# Altium schematic sheet universal driver.SchDoc
size A1
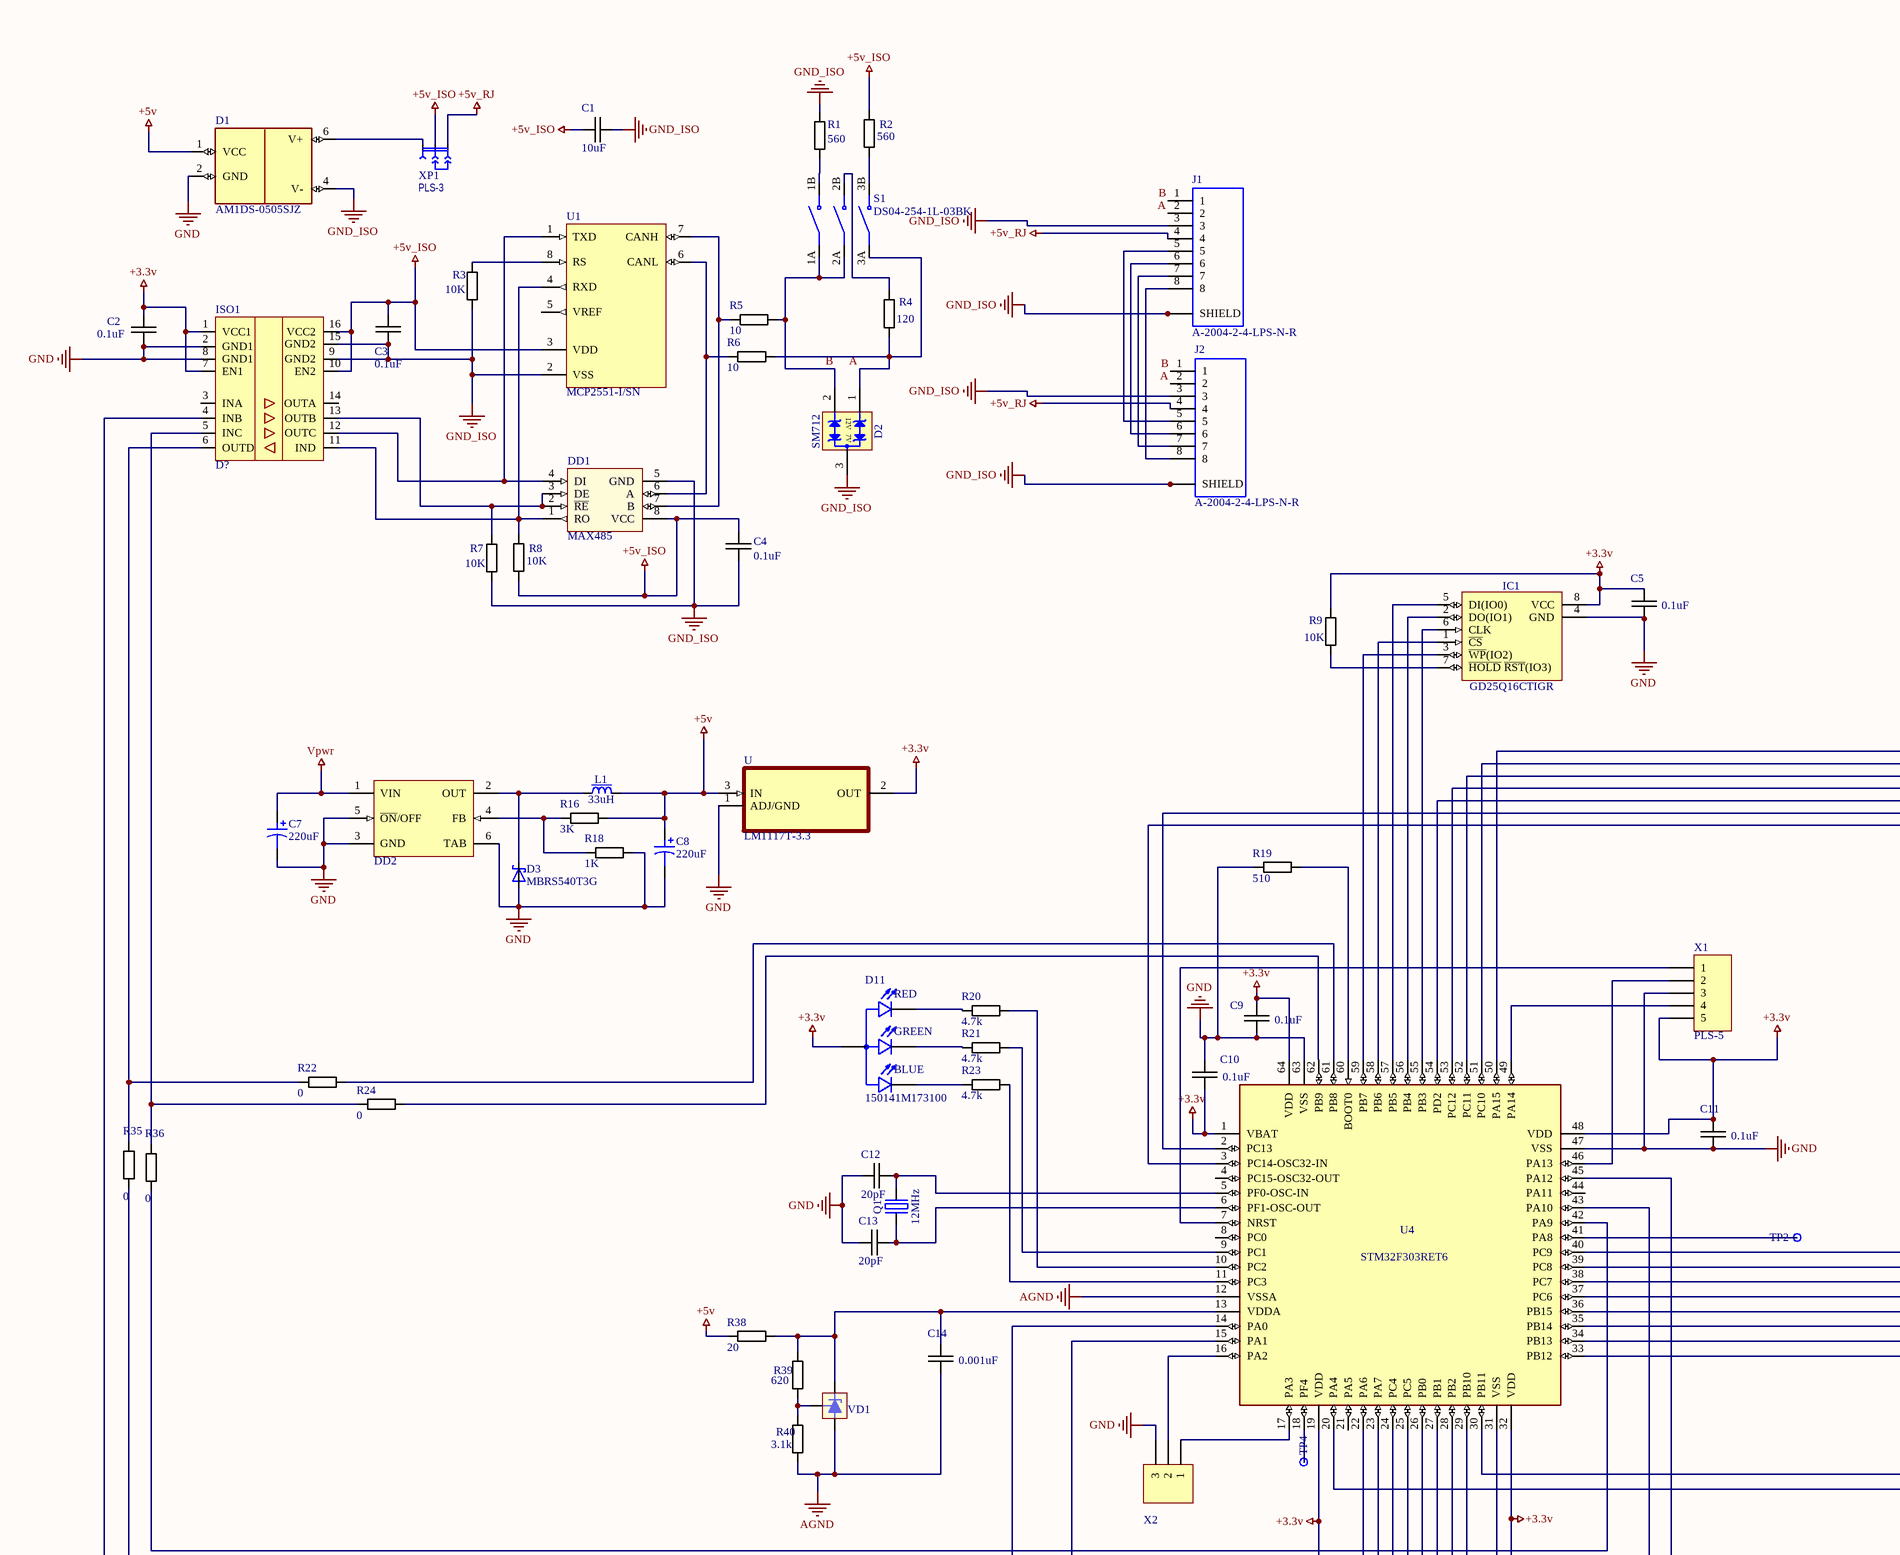
[diagram p0: universal driver.SchDoc, top left]
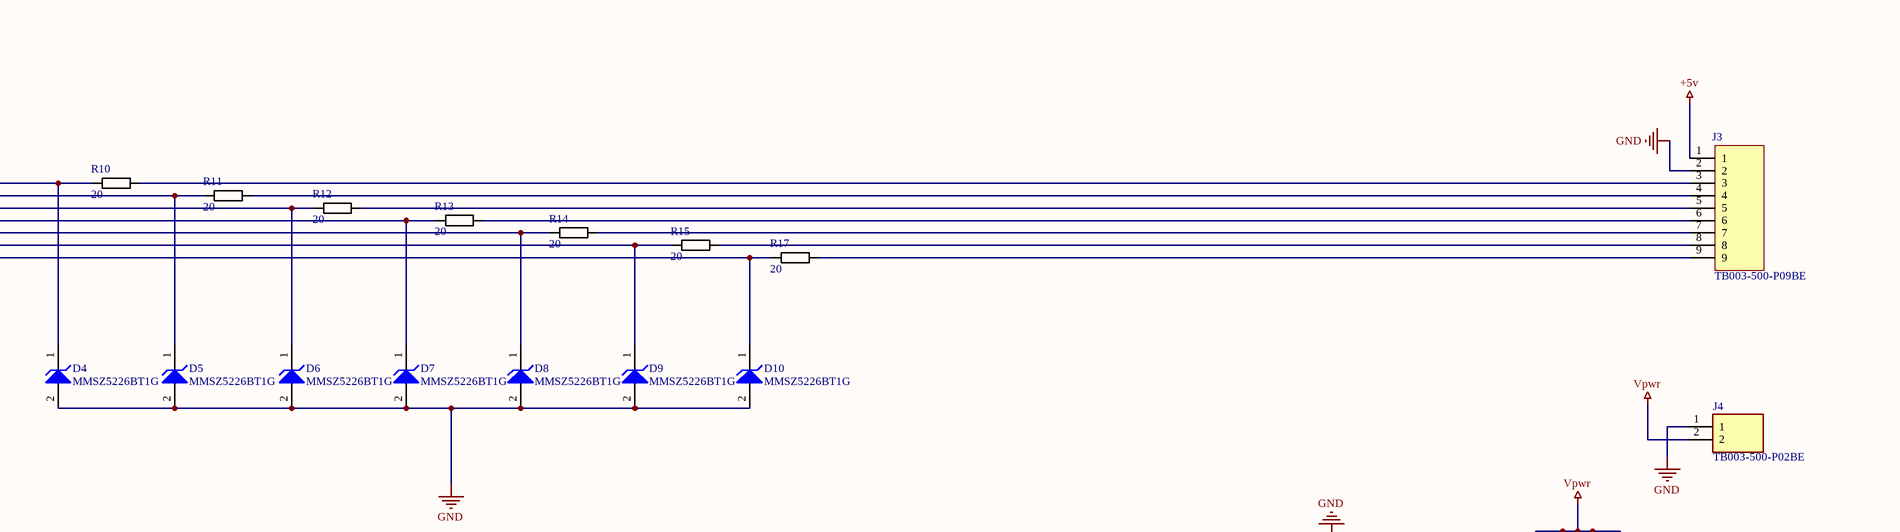
[diagram p1: universal driver.SchDoc, top right]
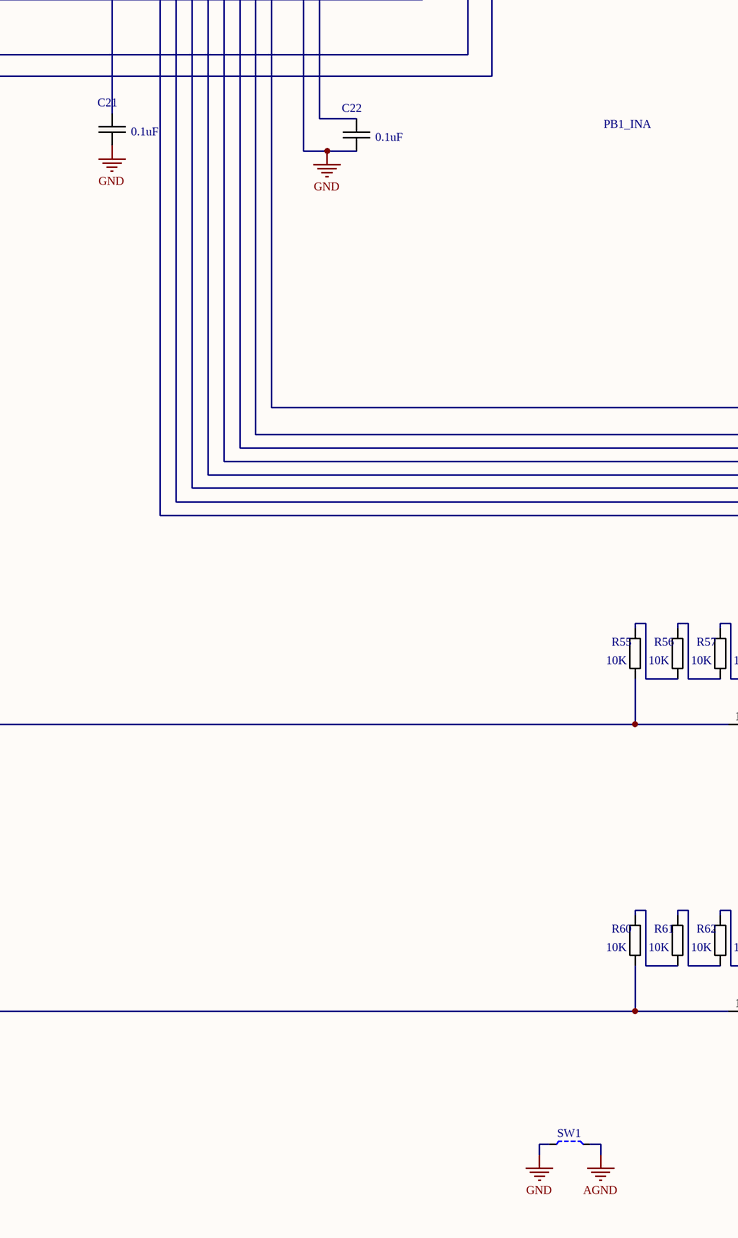
[diagram p2: universal driver.SchDoc, bottom left]
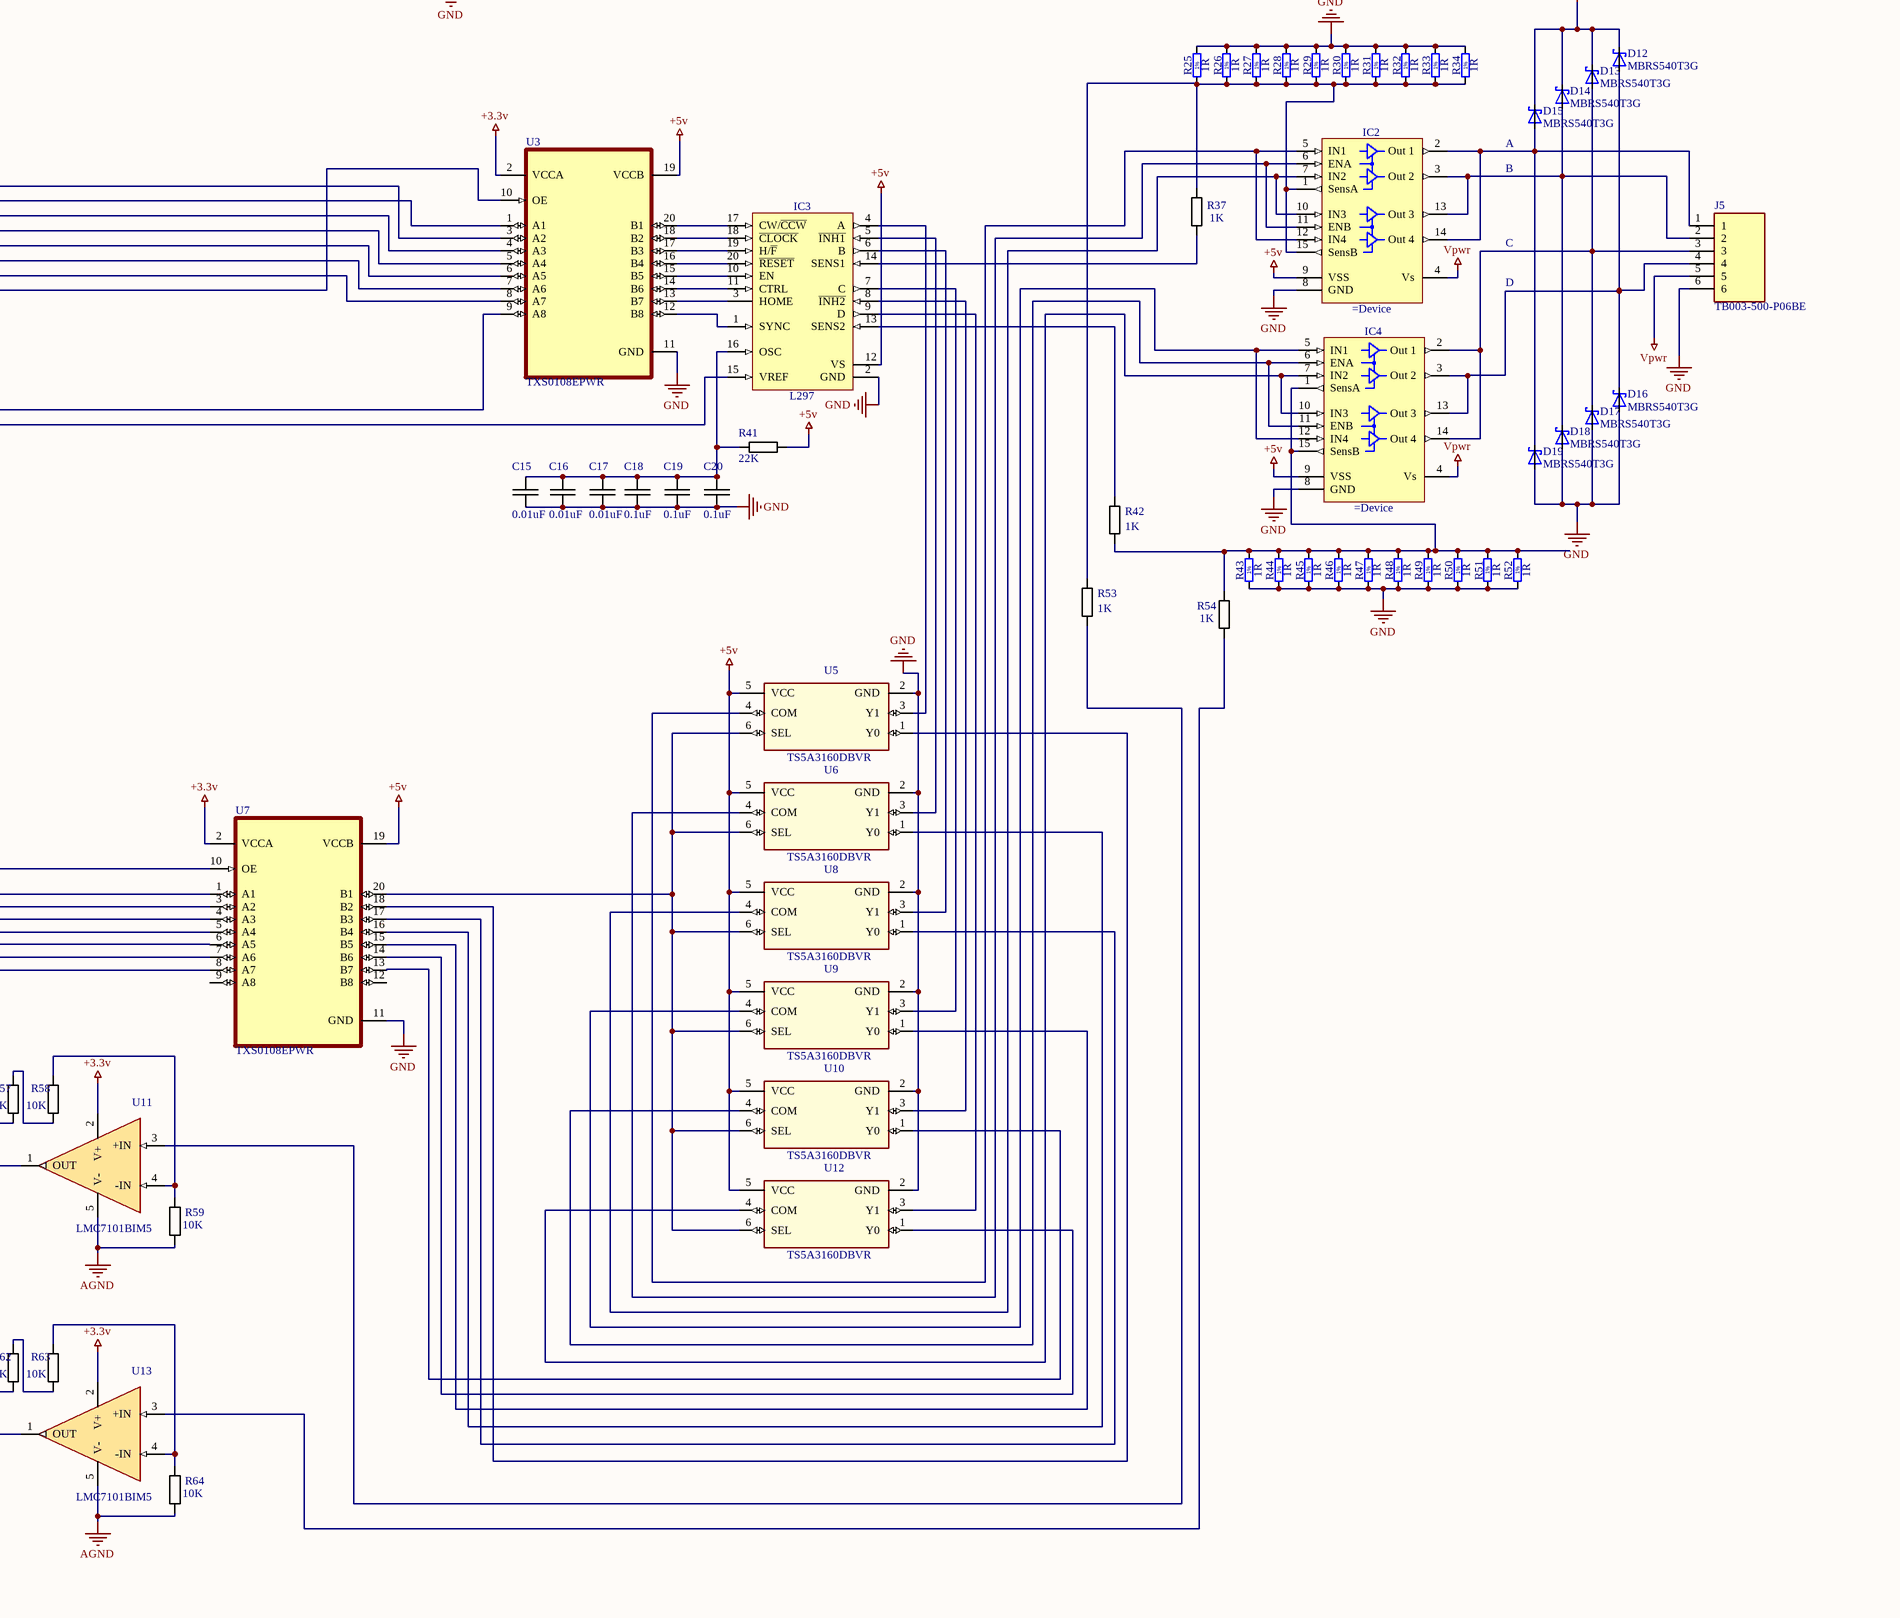
[diagram p3: universal driver.SchDoc, bottom right]

## Parts
C1  10uF  [CAPC3225X270N]
C2  0.1uF  [CAPACITOR 0603]
C3  0.1uF  [CAPACITOR 0603]
C4  0.1uF  [CAPACITOR 0603]
C5  0.1uF  [CAPACITOR 0603]
C7  value 220uF  [ECR 10x13mm]  (hidden comment: 220uF 50v)
C8  value 220uF  [ECR 10x13mm]  (hidden comment: 220uF 50v)
C9  0.1uF  [CAPACITOR 0603]
C10  0.1uF  [CAPACITOR 0603]
C11  0.1uF  [CAPACITOR 0603]
C12  20pF  [CAPACITOR 0603]
C13  20pF  [CAPACITOR 0603]
C14  0.001uF  [CAPACITOR 0603]
C15  0.01uF  [CAPACITOR 0603]
C16  0.01uF  [CAPACITOR 0603]
C17  0.01uF  [CAPACITOR 0603]
C18  0.1uF  [CAPACITOR 0603]
C19  0.1uF  [CAPACITOR 0603]
C20  0.1uF  [CAPACITOR 0603]
C21  0.1uF  [CAPACITOR 0603]
C22  0.1uF  [CAPACITOR 0603]
D1  AM1DS-0505SJZ  [AM2D-NZ]
D2  SM712  [SOT23]
D3  MBRS540T3G  [DIOM7958X213N]
D4  MMSZ5226BT1G  [ONSC-SOD-123-2-425-04_V]
D5  MMSZ5226BT1G  [ONSC-SOD-123-2-425-04_V]
D6  MMSZ5226BT1G  [ONSC-SOD-123-2-425-04_V]
D7  MMSZ5226BT1G  [ONSC-SOD-123-2-425-04_V]
D8  MMSZ5226BT1G  [ONSC-SOD-123-2-425-04_V]
D9  MMSZ5226BT1G  [ONSC-SOD-123-2-425-04_V]
D10  MMSZ5226BT1G  [ONSC-SOD-123-2-425-04_V]
D11  150141M173100  [LED_150141M173100]
D12  MBRS540T3G  [DIOM7958X213N]
D13  MBRS540T3G  [DIOM7958X213N]
D14  MBRS540T3G  [DIOM7958X213N]
D15  MBRS540T3G  [DIOM7958X213N]
D16  MBRS540T3G  [DIOM7958X213N]
D17  MBRS540T3G  [DIOM7958X213N]
D18  MBRS540T3G  [DIOM7958X213N]
D19  MBRS540T3G  [DIOM7958X213N]
DD1  MAX485  [NSO8]
DD2  LM2596S-ADJ  [TO-263]  (value not drawn)
IC1  GD25Q16CTIGR  [NSO8]
IC2  (no value)  [MW-15]
IC3  L297  [DIP850W45P254L2540H393Q20]
IC4  (no value)  [MW-15]
ISO1  D?  [*SOIC127P1030X265-16N]
J1  A-2004-2-4-LPS-N-R  [ASSMANN_A-2004-2-4-LPS-N-R]
J2  A-2004-2-4-LPS-N-R  [ASSMANN_A-2004-2-4-LPS-N-R]
J3  TB003-500-P09BE  [*CUI_TB003-500-P09BE]
J4  TB003-500-P02BE  [CUI_TB003-500-P02BE]
J5  TB003-500-P06BE  [CUI_TB003-500-P06BE]
L1  33uH  [SRR1208]
Q1  12MHz  [HC49SM]
R1  560  [Resistor 0805]
R2  560  [Resistor 0805]
R3  10K  [Resistor 0805]
R4  120  [Resistor 0805]
R5  10  [Resistor 0805]
R6  10  [Resistor 0805]
R7  10K  [Resistor 0805]
R8  10K  [Resistor 0805]
R9  10K  [Resistor 0805]
R10  20  [Resistor 0805]
R11  20  [Resistor 0805]
R12  20  [Resistor 0805]
R13  20  [Resistor 0805]
R14  20  [Resistor 0805]
R15  20  [Resistor 0805]
R16  3K  [Resistor 0805]
R17  20  [Resistor 0805]
R18  1K  [Resistor 0805]
R19  510  [Resistor 0805]
R20  4.7k  [Resistor 0805]
R21  4.7k  [Resistor 0805]
R22  0  [Resistor 0805]
R23  4.7k  [Resistor 0805]
R24  0  [Resistor 0805]
R25  1R  [R2512]
R26  1R  [R2512]
R27  1R  [R2512]
R28  1R  [R2512]
R29  1R  [R2512]
R30  1R  [R2512]
R31  1R  [R2512]
R32  1R  [R2512]
R33  1R  [R2512]
R34  1R  [R2512]
R35  0  [Resistor 0805]
R36  0  [Resistor 0805]
R37  1K  [Resistor 0805]
R38  20  [Resistor 0805]
R39  620  [Resistor 0805]
R40  3.1k  [Resistor 0805]
R41  22K  [Resistor 0805]
R42  1K  [Resistor 0805]
R43  1R  [R2512]
R44  1R  [R2512]
R45  1R  [R2512]
R46  1R  [R2512]
R47  1R  [R2512]
R48  1R  [R2512]
R49  1R  [R2512]
R50  1R  [R2512]
R51  1R  [R2512]
R52  1R  [R2512]
R53  1K  [Resistor 0805]
R54  1K  [Resistor 0805]
R55  10K  [Resistor 0805]
R56  10K  [Resistor 0805]
R57  10K  [Resistor 0805]
R58  10K  [Resistor 0805]
R59  10K  [Resistor 0805]
R60  10K  [Resistor 0805]
R61  10K  [Resistor 0805]
R62  10K  [Resistor 0805]
R63  10K  [Resistor 0805]
R64  10K  [Resistor 0805]
S1  DS04-254-1L-03BK  [SW_DS04-254-1L-03BK]
SW1  (no value)  [R - 1206]
TP2  (no value)  [TestPoint_SMD]
TP4  (no value)  [TestPoint_SMD]
U  LM1117T-3.3  [TO254P470X1016X2222-3P]
U1  MCP2551-I/SN  [SOIC-SN8_L]
U3  TXS0108EPWR  [SOP65P640X120-20N]
U4  STM32F303RET6  [QFP50P1200X1200X160-64N]
U5  TS5A3160DBVR  [*SOT95P280X145-6N]
U6  TS5A3160DBVR  [*SOT95P280X145-6N]
U7  TXS0108EPWR  [SOP65P640X120-20N]
U8  TS5A3160DBVR  [*SOT95P280X145-6N]
U9  TS5A3160DBVR  [*SOT95P280X145-6N]
U10  TS5A3160DBVR  [*SOT95P280X145-6N]
U11  LMC7101BIM5  [*SOT95P280X145-5N]
U12  TS5A3160DBVR  [*SOT95P280X145-6N]
U13  LMC7101BIM5  [*SOT95P280X145-5N]
VD1  TL431  [SOT23]  (value not drawn)
X1  PLS-5  [PLS-5-3D]
X2  PLS2-3  [PLS-3-2]  (value not drawn)
XP1  PLS-3  [ZL201-3]

## Nets
+3.3v: C2.1 C5.1 C9.1 C10.2 C11.1 C21.1 C22.1 D11.1(A) IC1.8(VCC) ISO1.1(VCC1) ISO1.7(EN1) R9.1 U.2(OUT) U3.2(VCCA) U4.1(VBAT) U4.19(VDD) U4.32(VDD) U4.48(VDD) U4.64(VDD) U7.2(VCCA) U11.2(V+) U13.2(V+) X1.5
+5v: C8.1 D1.1(VCC) IC2.9(VSS) IC3.12(VS) IC4.9(VSS) J3.1 L1.2 R16.2 R38.2 R41.2 U.3(IN) U3.19(VCCB) U5.5(VCC) U6.5(VCC) U7.19(VCCB) U8.5(VCC) U9.5(VCC) U10.5(VCC) U12.5(VCC)
+5v_ISO: C1.2 C3.2 C4.2 DD1.8(VCC) ISO1.10(EN2) ISO1.16(VCC2) R2.2 R8.1 U1.3(VDD) XP1.2
+5v_RJ: J1.4 J2.4 XP1.1
AGND: C14.2 R40.2 R59.1 R64.1 SW1.2 U4.12(VSSA) U11.5(V-) U13.5(V-) VD1.3(A)
GND: C2.2 C5.2 C7.2 C8.2 C9.2 C10.1 C11.2 C12.1 C13.1 C15.2 C16.2 C17.2 C18.2 C19.2 C20.2 C21.2 C22.2 D1.2(GND) D3.A D4.2(A) D5.2(A) D6.2(A) D7.2(A) D8.2(A) D9.2(A) D10.2(A) D16.A D17.A D18.A D19.A DD2.3(GND) DD2.5(~{ON}/OFF) DD2.6(TAB) IC1.4(GND) IC2.8(GND) IC3.2(GND) IC4.8(GND) ISO1.2(GND1) ISO1.8(GND1) J3.2 J4.1 J5.6 R18.2 R19.2 R25.2 R26.2 R27.2 R28.2 R29.2 R30.2 R31.2 R32.2 R33.2 R34.2 R43.1 R44.1 R45.1 R46.1 R47.1 R48.1 R49.1 R50.1 R51.1 R52.1 SW1.1 U.1(ADJ/GND) U3.11(GND) U4.31(VSS) U4.47(VSS) U4.63(VSS) U5.2(GND) U6.2(GND) U7.11(GND) U8.2(GND) U9.2(GND) U10.2(GND) U12.2(GND) X1.3 X2.3
GND_ISO: C1.1 C3.1 C4.1 D1.4(V-) D2.3(GND) DD1.5(GND) ISO1.9(GND2) ISO1.15(GND2) J1.3 J1.S1(SHIELD) J1.S2(SHIELD) J2.3 J2.S1(SHIELD) J2.S2(SHIELD) R1.2 R3.1 R7.2 U1.2(VSS)
Vpwr: C7.1 D12.C D13.C D14.C D15.C DD2.1(VIN) IC2.4(Vs) IC4.4(Vs) J4.2 J5.5
A: D2.1(I/O1) J1.2 J2.2 R4.2 R6.1 S1.3A(COM3)
B: D2.2(I/O2) J1.1 J2.1 R5.1 S1.1A(COM1) S1.2A(COM2)
NetC12_2: C12.2 Q1.2(OSC2) U4.5(PF0-OSC-IN)
NetC13_2: C13.2 Q1.1(OSC1) U4.6(PF1-OSC-OUT)
NetC14_1: C14.1 R38.1 R39.1 U4.13(VDDA) VD1.1(K)
NetC15_1: C15.1 C16.1 C17.1 C18.1 C19.1 C20.1 IC3.16(OSC) R41.1
NetD1_6: D1.6(V+) XP1.3
NetD3_C: D3.C DD2.2(OUT) L1.1
NetD4_1: D4.1(K) R10.2 U4.50(PA15)
NetD5_1: D5.1(K) R11.2 U4.51(PC10)
NetD6_1: D6.1(K) R12.2 U4.52(PC11)
NetD7_1: D7.1(K) R13.2 U4.53(PC12)
NetD8_1: D8.1(K) R14.2 U4.54(PD2)
NetD9_1: D9.1(K) R15.2 U4.2(PC13)
NetD10_1: D10.1(K) R17.2 U4.3(PC14-OSC32-IN)
NetD11_2: D11.2(B_C) R23.2
NetD11_3: D11.3(R_C) R20.2
NetD11_4: D11.4(G_C) R21.2
NetD12_A: D12.A D16.C IC4.3(Out_2) IC4.13(Out_3) J5.4
NetD13_A: D13.A D17.C IC4.2(Out_1) IC4.14(Out_4) J5.3
NetD14_A: D14.A D18.C IC2.3(Out_2) IC2.13(Out_3) J5.2
NetD15_A: D15.A D19.C IC2.2(Out_1) IC2.14(Out_4) J5.1
NetDD1_1: DD1.1(RO) ISO1.11(IND) R8.2 U1.4(RXD)
NetDD1_2: DD1.2(~{RE}) DD1.3(DE) ISO1.13(OUTB) R7.1
NetDD1_4: DD1.4(DI) ISO1.12(OUTC) U1.1(TXD)
NetDD1_6: DD1.6(A) R6.2 U1.6(CANL)
NetDD1_7: DD1.7(B) R5.2 U1.7(CANH)
NetDD2_4: DD2.4(FB) R16.1 R18.1
NetIC1_1: IC1.1(~{CS}) U4.58(PB6)
NetIC1_2: IC1.2(DO(IO1)) U4.56(PB4)
NetIC1_3: IC1.3(~{WP}(IO2)) U4.59(PB7)
NetIC1_5: IC1.5(DI(IO0)) U4.57(PB5)
NetIC1_6: IC1.6(CLK) U4.55(PB3)
NetIC1_7: IC1.7(~{HOLD}_~{RST}(IO3)) R9.2
NetIC2_1: IC2.1(SensA) IC2.15(SensB) R25.1 R26.1 R27.1 R28.1 R29.1 R30.1 R31.1 R32.1 R33.1 R34.1 R37.2 R53.2
NetIC2_5: IC2.5(IN1) IC2.12(IN4) U5.4(COM)
NetIC2_6: IC2.6(ENA) IC2.11(ENB) U6.4(COM)
NetIC2_7: IC2.7(IN2) IC2.10(IN3) U8.4(COM)
NetIC3_1: IC3.1(SYNC) U3.12(B8)
NetIC3_3: IC3.3(HOME) U3.13(B7)
NetIC3_4: IC3.4(A) U5.3(Y1)
NetIC3_5: IC3.5(~{INH1}) U6.3(Y1)
NetIC3_6: IC3.6(B) U8.3(Y1)
NetIC3_7: IC3.7(C) U9.3(Y1)
NetIC3_8: IC3.8(~{INH2}) U10.3(Y1)
NetIC3_9: IC3.9(D) U12.3(Y1)
NetIC3_10: IC3.10(EN) U3.15(B5)
NetIC3_11: IC3.11(CTRL) U3.14(B6)
NetIC3_13: IC3.13(SENS2) R42.2
NetIC3_14: IC3.14(SENS1) R37.1
NetIC3_15: IC3.15(VREF) U4.20(PA4)
NetIC3_17: IC3.17(CW/~{CCW}) U3.20(B1)
NetIC3_18: IC3.18(~{CLOCK}) U3.18(B2)
NetIC3_19: IC3.19(H/~{F}) U3.17(B3)
NetIC3_20: IC3.20(~{RESET}) U3.16(B4)
NetIC4_1: IC4.1(SensA) IC4.15(SensB) R42.1 R43.2 R44.2 R45.2 R46.2 R47.2 R48.2 R49.2 R50.2 R51.2 R52.2 R54.2
NetIC4_5: IC4.5(IN1) IC4.12(IN4) U9.4(COM)
NetIC4_6: IC4.6(ENA) IC4.11(ENB) U10.4(COM)
NetIC4_7: IC4.7(IN2) IC4.10(IN3) U12.4(COM)
NetISO1_4: ISO1.4(INB) U4.45(PA12)
NetISO1_5: ISO1.5(INC) R24.2 R36.1
NetISO1_6: ISO1.6(OUTD) R22.2 R35.1
NetJ1_5: J1.5 J2.5
NetJ1_6: J1.6 J2.6
NetJ1_7: J1.7 J2.7
NetJ1_8: J1.8 J2.8
NetJ3_3: J3.3 R10.1
NetJ3_4: J3.4 R11.1
NetJ3_5: J3.5 R12.1
NetJ3_6: J3.6 R13.1
NetJ3_7: J3.7 R14.1
NetJ3_8: J3.8 R15.1
NetJ3_9: J3.9 R17.1
NetR1_1: R1.1 S1.1B(NO1)
NetR2_1: R2.1 S1.3B(NO3)
NetR3_2: R3.2 U1.8(RS)
NetR4_1: R4.1 S1.2B(NO2)
NetR19_1: R19.1 U4.60(BOOT0)
NetR20_1: R20.1 U4.10(PC2)
NetR21_1: R21.1 U4.9(PC1)
NetR22_1: R22.1 U4.61(PB8)
NetR23_1: R23.1 U4.11(PC3)
NetR24_1: R24.1 U4.62(PB9)
NetR35_2: R35.2 U4.43(PA10)
NetR36_2: R36.2 U4.42(PA9)
NetR39_2: R39.2 R40.1 VD1.2(VREF)
NetR53_1: R53.1 U11.3(+IN)
NetR54_1: R54.1 U13.3(+IN)
NetR55_1: R55.1 R56.2
NetR55_2: R55.2 U4.15(PA1) U11.1(OUT)
NetR56_1: R56.1 R57.2
NetR57_1: R57.1 R58.2
NetR58_1: R58.1 R59.2 U11.4(-IN)
NetR60_1: R60.1 R61.2
NetR60_2: R60.2 U4.14(PA0) U13.1(OUT)
NetR61_1: R61.1 R62.2
NetR62_1: R62.1 R63.2
NetR63_1: R63.1 R64.2 U13.4(-IN)
NetTP2_1: TP2.1 U4.41(PA8)
NetTP4_1: TP4.1 U4.18(PF4)
NetU3_1: U3.1(A1) U4.39(PC8)
NetU3_3: U3.3(A2) U4.40(PC9)
NetU3_4: U3.4(A3) U4.38(PC7)
NetU3_5: U3.5(A4) U4.37(PC6)
NetU3_6: U3.6(A5) U4.36(PB15)
NetU3_7: U3.7(A6) U4.35(PB14)
NetU3_8: U3.8(A7) U4.34(PB13)
NetU3_9: U3.9(A8) U4.30(PB11)
NetU3_10: U3.10(OE) U4.33(PB12)
NetU4_7: U4.7(NRST) X1.1
NetU4_16: U4.16(PA2) X2.2
NetU4_17: U4.17(PA3) X2.1
NetU4_22: U4.22(PA6) U7.8(A7)
NetU4_23: U4.23(PA7) U7.7(A6)
NetU4_24: U4.24(PC4) U7.6(A5)
NetU4_25: U4.25(PC5) U7.5(A4)
NetU4_26: U4.26(PB0) U7.4(A3)
NetU4_27: U4.27(PB1) U7.3(A2)
NetU4_28: U4.28(PB2) U7.1(A1)
NetU4_29: U4.29(PB10) U7.10(OE)
NetU4_46: U4.46(PA13) X1.2
NetU4_49: U4.49(PA14) X1.4
NetU5_1: U5.1(Y0) U7.18(B2)
NetU5_6: U5.6(SEL) U6.6(SEL) U7.20(B1) U8.6(SEL) U9.6(SEL) U10.6(SEL) U12.6(SEL)
NetU6_1: U6.1(Y0) U7.16(B4)
NetU7_13: U7.13(B7) U10.1(Y0)
NetU7_14: U7.14(B6) U12.1(Y0)
NetU7_15: U7.15(B5) U9.1(Y0)
NetU7_17: U7.17(B3) U8.1(Y0)

Not connected (* = marked no-connect by the designer): ISO1 3(INA) 14(OUTA); U1 5(VREF); U4 4(PC15-OSC32-OUT) 8(PC0) 21(PA5) 44(PA11); U7 9(A8) 12(B8)

## Notes on the sheet
- (near D15) A
- B
- C
- D
- PB1_INA
- (in symbol 150141M173100) RED; GREEN; BLUE
- (in symbol Resistor - 1%) 1%
- (in symbol SM712) 12V; 7V

## Library data of the parts
C1-C5 C9-C22 = Capasitor: Value: *
C7 C8 = Cap Pol: Polarized Capacitor (Rad); Voltage: 50; Type: Type; URL: http://www.hitano.com.tw/PDF/ECR_081225.pdf
D2 = SM712: Asymmetrical TVS Diode for Extended Common-Mode RS-485
D3 D12-D19 = MBRS540T3G: Diode Schottky 40V 5A Surface Mount SMC; MF: ON Semiconductor; SnapEDA_Link: https://www.snapeda.com/parts/MBRS540T3G/ON%20Semiconductor/view-part/78777/?ref=snap; MP: MBRS540T3G; Availability: Unavailable; Price: None; Value: *; Package: DO-214 ON Semiconductor
D4-D10 = MMSZ5226BT1G: Zener Voltage Regulator, 500 mW, 2-Pin SOD-123, Pb-Free, Tape and Reel; Manufacturer: On Semiconductor; P Max (W): 0.5; VZ Typ (V): 3.3; DatasheetVersion: Rev. 12; PackageVersion: Rev. G, 10/2009; PackageReference: SOD-123-2-425-04; PackageDescription: 2-Pin SOD, Body 1.6 x 2.69 mm; Supplier 1: Digi-Key; Supplier Part Number 1: MMSZ5226BT1GOSTR-ND; Supplier 2: Digi-Key; Supplier Part Number 2: MMSZ5226BT1GOSCT-ND; Supplier 3: Digi-Key; Supplier Part Number 3: MMSZ5226BT1GOSDKR-ND; Supplier 4: Farnell; Supplier Part Number 4: 1431269; Supplier 5: Farnell; Supplier Part Number 5: 1431269RL; Supplier 6: Farnell; Supplier Part Number 6: 2370825; Supplier 7: Newark; Supplier Part Number 7: 67R1367; Supplier 8: Newark; Supplier Part Number 8: 45J1591; Supplier 9: Mouser; Supplier Part Number 9: 863-MMSZ5226BT1G; Packing: Tape and Reel; RoHS: Pb-Free; Mounting Technology: Surface Mount; PartNumber: MMSZ5226BT1G; ComponentLink1Description: Manufacturer URL; ComponentLink1URL: http://www.onsemi.com/; ComponentLink2Description: Datasheet; ComponentLink2URL: http://www.onsemi.com/pub_link/Collateral/MMSZ5221BT1-D.PDF; ComponentLink3Description: Package Specification; ComponentLink3URL: http://www.onsemi.com/pub_link/Collateral/425-04.PDF
D11 = 150141M173100: Red, Green, Blue _RGB_ 625nm Red, 520nm Green, 470nm Blue LED Indication - Discrete 2V Red, 3.2V Green, 3.2V Blue 1411 _3528 Metric_; MF: Wurth Electronics; SnapEDA_Link: https://www.snapeda.com/parts/150141M173100/Wurth%20Electronics%20Inc./view-part/281733/?ref=snap; Price: None; MP: 150141M173100; Package: 1411 WÃ¼rth Elektronik; Value: *; Availability: Unavailable
DD1 = MAX485: Low-Power, Slew-Rate-Limited RS-485/RS-422 Transceiver; ComponentLink1URL: http://pdfserv.maxim-ic.com/en/ds/MAX1487-MAX491.pdf; Type: MAX485
DD2 = LM2596S-ADJ: SIMPLE SWITCHER® Power Converter 150 KHz 3A Step-Down Voltage Regulator, 5-pin TO-263; Manufacturer: National Semiconductor; Published: 13.04.2012; Publisher: Reukov A.V.; PartNumber: LM2596S-ADJ; CompType: Switcher; ComponentLink1URL: http://www.national.com/ds/LM/LM2596.pdf; ComponentLink2URL: http://www.national.com/pf/LM/LM2596.html; ComponentLink3URL: http://www.national.com/packaging/folders/ts5b.html
IC1 = W25Q128FVEIG: 128M-bit Serial Flash Memory with uniform 4KB sectors and Dual/Quad SPI and QPI
IC2 IC4 = L298N: Dual Full-Bridge Driver
IC3 = L297: Stepper Motor Controller
ISO1 = ISO7341
J1 J2 = A-2004-2-4-LPS-N-R: Jack Modular Connector 8p8c _RJ45, Ethernet_ 90Â° Angle _Right_ Shielded; MF: Assmann WSW; Package: None; MP: A-2004-2-4-LPS-N-R; Value: *; Price: None; Availability: Unavailable; SnapEDA_Link: https://www.snapeda.com/parts/A-2004-2-4-LPS-N-R/Assmann%20WSW%20Components/view-part/454861/?ref=snap
J3 = TB003-500-P09BE: 2~24 Poles, Screw Type, Horizontal, 5.0 Pitch, 26~14 (AWG), Terminal Block Connector; MF: CUI Devices; Check_prices: https://www.snapeda.com/parts/TB003-500-P09BE/CUI%20Devices/view-part/3590672/?ref=eda; Availability: Warning; Price: None; MP: TB003-500-P09BE; DigiKey-Purchase-URL: https://snapeda.com/shop?store=DigiKey&id=3590672; Package: None; SnapEDA_Link: https://www.snapeda.com/parts/TB003-500-P09BE/CUI%20Devices/view-part/3590672/?ref=snap; Mouser-Purchase-URL: https://snapeda.com/shop?store=Mouser&id=3590672; CUI_purchase_URL: https://www.cuidevices.com/product/interconnect/connectors/terminal-blocks/tb003-500-series?utm_source=snapeda.com&utm_medium=referral&utm_campaign=snapedaBOM; Value: *
J4 = TB003-500-P02BE: 2~24 Poles, Screw Type, Horizontal, 5.0 Pitch, 26~14 _AWG_, Terminal Block Connector; MF: CUI Devices; MP: TB003-500-P02BE; Availability: Unavailable; Package: None; SnapEDA_Link: https://www.snapeda.com/parts/TB003-500-P02BE/CUI%20Devices/view-part/3590637/?ref=snap; Price: None; Value: *
J5 = TB003-500-P06BE: 2~24 Poles, Screw Type, Horizontal, 5.0 Pitch, 26~14 _AWG_, Terminal Block Connector; MF: CUI Devices; Value: *; Price: None; MP: TB003-500-P06BE; SnapEDA_Link: https://www.snapeda.com/parts/TB003-500-P06BE/CUI%20Devices/view-part/3590657/?ref=snap; Package: None; Availability: Unavailable
L1 = Inductor With Magnetic core: Inductor With Core
Q1 = Quartz Crystal
R1-R24 R35-R42 R53-R64 = Resistor: Value: *
R25-R34 R43-R52 = Resistor - 1%
S1 = DS04-254-1L-03BK: 3 Pole, Raised Actuator, Flat Bottom, Long Pin, DIP Switch; MF: CUI Devices; Price: None; SnapEDA_Link: https://www.snapeda.com/parts/DS04-254-1L-03BK/CUI%20Devices/view-part/4467361/?ref=snap; Availability: Unavailable; Value: *; MP: DS04-254-1L-03BK; Package: None
SW1 = SMD Solder Jumper: 2 SMD Pads for Bound by Solder  Drop
TP2 TP4 = Test Point
U = LM1117T-3.3: Linear Voltage Regulator IC 1 Output 800mA TO-220-3; MF: Texas Instruments; MP: LM1117T-3.3; Price: None; Availability: Unavailable; Package: TO-220 Texas Instruments; SnapEDA_Link: https://www.snapeda.com/parts/LM1117T-3.3/Texas%20Instruments/view-part/103788/?ref=snap; Value: *
U1 = MCP2551-I/SN: High-Speed CAN Transceiver, 8-Pin SOIC, Industrial Temperature; Published: 29-Jan-2009; DatasheetVersion: revE, Jan-2007; PackageVersion: revBB, Aug-2009; PackageReference: SOIC-SN8; Publisher: Altium Limited; PackageDescription: 8-Lead Plastic Small Outline (SN) - Narrow, 3.90mm Body [SOIC]; Supplier 1: Digi-Key; Supplier Part Number 1: MCP2551-I/SN-ND; Supplier 2: Farnell; Supplier Part Number 2: 9758569; Code_JEDEC: MS-012; Code_IPC: SOIC127P600-8; ComponentLink1Description: Datasheet; ComponentLink1URL: http://ww1.microchip.com/downloads/en/DeviceDoc/21667E.pdf; ComponentLink2Description: Packaging Specification; ComponentLink2URL: http://www.microchip.com/stellent/groups/techpub_sg/documents/packagingspec/en012702.pdf; ComponentLink3Description: Microchip.com Home; ComponentLink3URL: http://www.microchip.com/
U3 U7 = TXS0108EPWR: 8-Bit Bidirectional Voltage-Level Shifter For Open-Drain And Push-Pull Application; MF: Texas Instruments; DigiKey-Purchase-URL: https://snapeda.com/shop?store=DigiKey&id=105750; Value: *; MP: TXS0108EPWR; Texas_Instruments-Purchase-URL: https://snapeda.com/shop?store=Texas+Instruments&id=105750; Availability: Unavailable; Package: TSSOP-20 Texas Instruments; Mouser-Purchase-URL: https://snapeda.com/shop?store=Mouser&id=105750; SnapEDA_Link: https://www.snapeda.com/parts/TXS0108EPWR/Texas%20Instruments/view-part/105750/?ref=snap; Price: None
U4 = STM32F303RET6: ARMÂ® CortexÂ®-M4 STM32F3 Microcontroller IC 32-Bit 72MHz 512KB _512K x 8_ FLASH 64-LQFP _10x10_; MF: STMicroelectronics; SnapEDA_Link: https://www.snapeda.com/parts/STM32F303RET6/STMicroelectronics/view-part/226642/?ref=snap; Availability: Unavailable; MP: STM32F303RET6; Value: *; Price: None; Package: LQFP-64 STMicroelectronics
U5 U6 U8-U10 U12 = TS5A3160DBVR: 1-?, 5-V, 2:1 (SPDT), analog switch (6-pin SOT-23, SC70 packages) 6-SOT-23 -40 to 85; MF: Texas Instruments; DigiKey-Purchase-URL: https://snapeda.com/shop?store=DigiKey&id=332002; Arrow_Electronics-Purchase-URL: https://snapeda.com/shop?store=Arrow+Electronics&id=332002; Texas_Instruments-Purchase-URL: https://snapeda.com/shop?store=Texas+Instruments&id=332002; Package: SOT-23-6 Texas Instruments; Availability: Good; MP: TS5A3160DBVR; Check_prices: https://www.snapeda.com/parts/TS5A3160DBVR/Texas%20Instruments/view-part/332002/?ref=eda; Mouser-Purchase-URL: https://snapeda.com/shop?store=Mouser&id=332002; SnapEDA_Link: https://www.snapeda.com/parts/TS5A3160DBVR/Texas%20Instruments/view-part/332002/?ref=snap; Price: None; Value: *
VD1 = TL431: Adjustable Precision Shunt Regulator; Class: Электронные компоненты; SubClass: Стабилитроны; Power_W: {Power_W}; Pitch_mm: {Pitch_mm}; Ordering_Information: {Ordering_Information}; Nominal_voltage_V: {Nominal_voltage_V}; Installation: {Installation}; Body: {Body}; Pins: 3; Value: TL431
X1 = PLS-5: Header, 5-Pin; LatestRevisionDate: 17-Jul-2002; LatestRevisionNote: Re-released for DXP Platform.; Publisher: Altium Limited
X2 = PLS2-3: Header, 3-Pin; LatestRevisionDate: 17-Jul-2002; LatestRevisionNote: Re-released for DXP Platform.; Publisher: Altium Limited
XP1 = Select jump: Connector, 3-Pin; Class: Электронные компоненты; SubClass: Разъемы; Pitch_mm: {Pitch_mm}; Installation: DIP; Ordering_Information: {Ordering_Information}; Type_of_connector: {Type_of_connector}; Pins: 3; Value: PLS-3
U11 U13 = LMC7101BIM5: Check_prices: https://www.snapeda.com/parts/LMC7101BIM5/Texas%20Instruments/view-part/19255/?ref=eda; SnapEDA_Link: https://www.snapeda.com/parts/LMC7101BIM5/Texas%20Instruments/view-part/19255/?ref=snap; Value: *